# Altium schematic sheet FFT.SchDoc
size A3
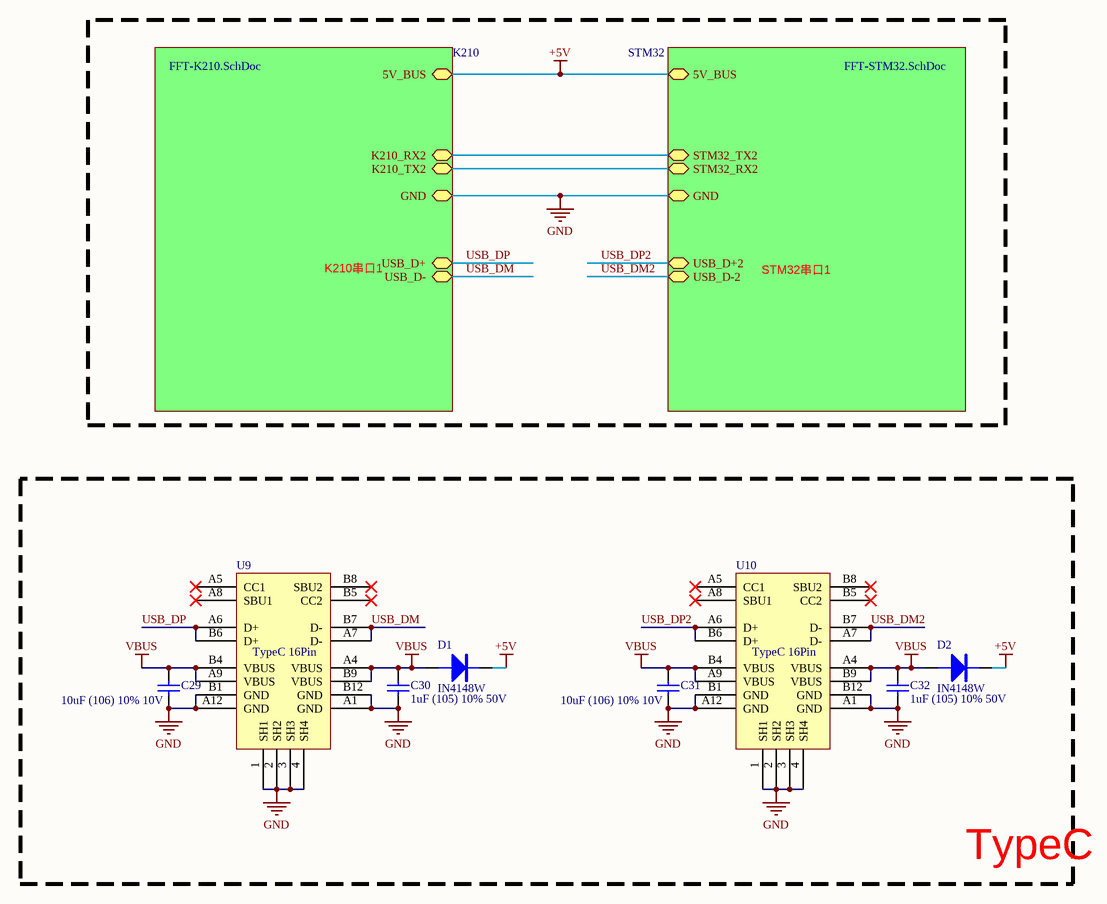
[diagram p0: FFT.SchDoc]

## Parts
C29  10uF (106) 10% 10V  [LC-0603_C]
C30  1uF (105) 10% 50V  [LC-0603_C]
C31  10uF (106) 10% 10V  [LC-0603_C]
C32  1uF (105) 10% 50V  [LC-0603_C]
D1  IN4148W  [SOD-123]
D2  IN4148W  [SOD-123]
U9  TypeC 16Pin  [Type-C]
U10  TypeC 16Pin  [Type-C]

## Blocks framed on the sheet
TypeC: C29-C32 D1 D2 U9 U10

## Sub-sheets
K210 = FFT-K210.SchDoc: USB_D+, USB_D-, 5V_BUS, GND, K210_TX2, K210_RX2
STM32 = FFT-STM32.SchDoc: GND, 5V_BUS, STM32_TX2, STM32_RX2, USB_D+2, USB_D-2

## Nets
+5V: D1.K D2.K ; sheet STM32/5V_BUS, sheet K210/5V_BUS
GND: C29.1 C30.1 C31.1 C32.1 U9.1(SH1) U9.2(SH2) U9.3(SH3) U9.4(SH4) U9.A1(GND) U9.A12(GND) U9.B1(GND) U9.B12(GND) U10.1(SH1) U10.2(SH2) U10.3(SH3) U10.4(SH4) U10.A1(GND) U10.A12(GND) U10.B1(GND) U10.B12(GND) ; sheet STM32/GND, sheet K210/GND
VBUS: C29.2 C30.2 C31.2 C32.2 D1.A D2.A U9.A4(VBUS) U9.A9(VBUS) U9.B4(VBUS) U9.B9(VBUS) U10.A4(VBUS) U10.A9(VBUS) U10.B4(VBUS) U10.B9(VBUS)
USB_DM: U9.A7(D-) U9.B7(D-) ; sheet K210/USB_D-
USB_DM2: U10.A7(D-) U10.B7(D-) ; sheet STM32/USB_D-2
USB_DP: U9.A6(D+) U9.B6(D+) ; sheet K210/USB_D+
USB_DP2: U10.A6(D+) U10.B6(D+) ; sheet STM32/USB_D+2
(unnamed): sheet STM32/STM32_TX2, sheet K210/K210_RX2
(unnamed): sheet STM32/STM32_RX2, sheet K210/K210_TX2

Not connected (* = marked no-connect by the designer): U9 A5(CC1)* A8(SBU1)* B5(CC2)* B8(SBU2)*; U10 A5(CC1)* A8(SBU1)* B5(CC2)* B8(SBU2)*

## Notes on the sheet
- K210串口1
- STM32串口1

## Library data of the parts
C29 C31 = 0603 10uF (106) 10% 10V: 贴片电容; ComponentLink1Description: 供应商链接; ComponentLink1URL: http://www.szlcsc.com/product/details_20411.html; Package: 0603; Supplier: LC; SuppliersPartNumber: C19702
C30 C32 = 0603 1uF (105) 10% 50V: 贴片电容; ComponentLink1Description: 供应商链接; ComponentLink1URL: http://www.szlcsc.com/product/details_16531.html; Package: 0603; Supplier: LC; SuppliersPartNumber: C15849
D1 D2 = DIODE: 开关二极管
U9 U10 = TypeC